# EAGLE design 89c2051-tandy1k-ps2 (EAGLE 4.16)
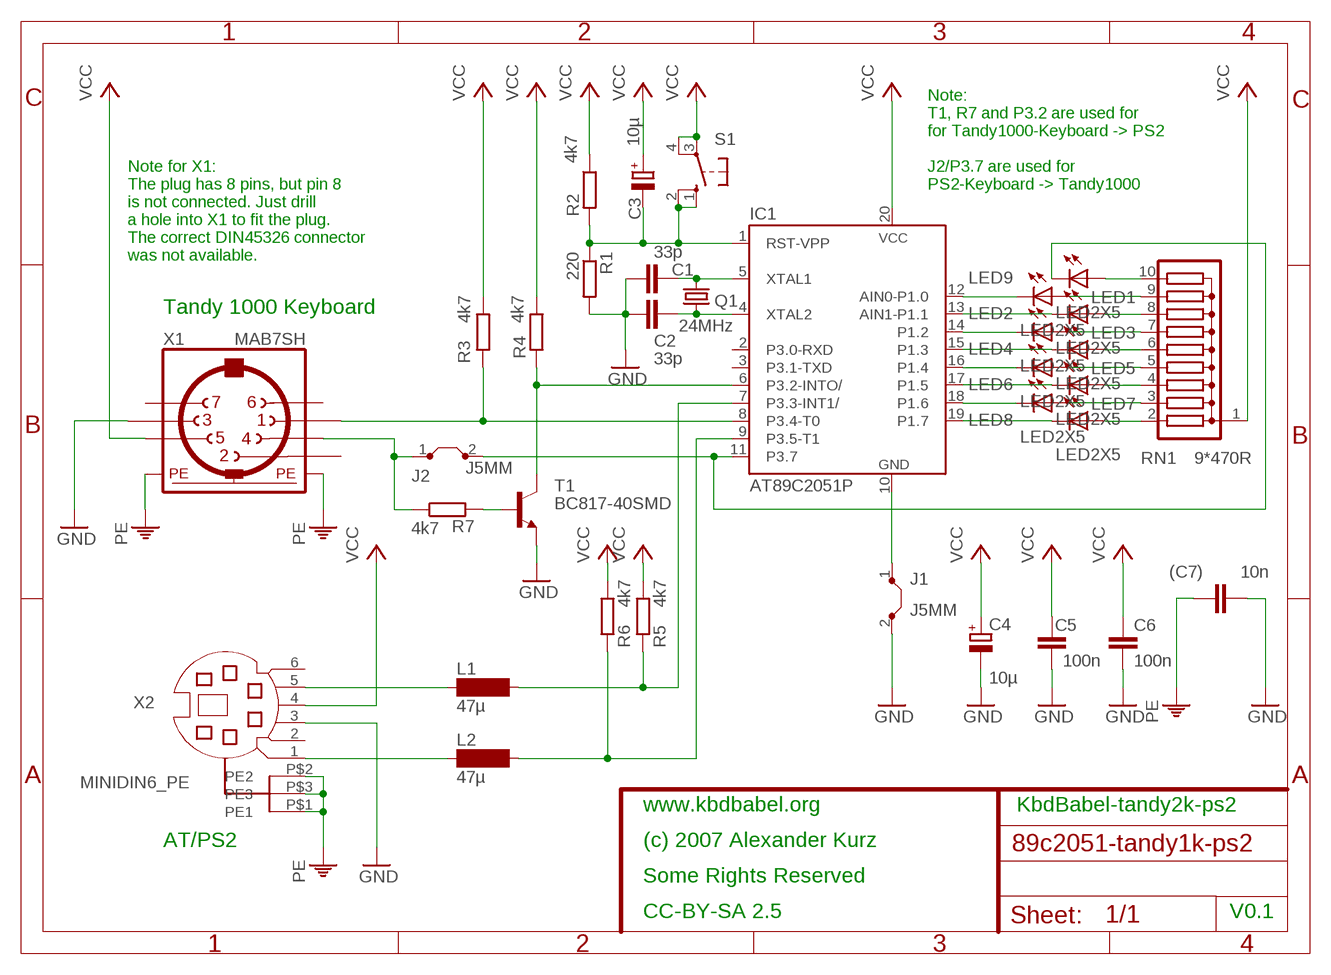
[diagram p0: schematic, sheet 1]

## Parts
(C7)  10n  C-EUC1206K  [C1206K]
C1  33p  C-EUC0805K  [C0805K]
C2  33p  C-EUC0805K  [C0805K]
C3  10µ  CPOL-EUE2-5  [E2-5]
C4  10µ  CPOL-EUE2-5  [E2-5]
C5  100n  C-EUC1206K  [C1206K]
C6  100n  C-EUC1206  [C1206]
IC1  AT89C2051P  [DIL20]
J1  J5MM  [05]
J2  J5MM  [05]
L1  47µ  SD75  [SD75]
L2  47µ  SD75  [SD75]
LED1  LED2X5  [LED2X5]
LED2  LED2X5  [LED2X5]
LED3  LED2X5  [LED2X5]
LED4  LED2X5  [LED2X5]
LED5  LED2X5  [LED2X5]
LED6  LED2X5  [LED2X5]
LED7  LED2X5  [LED2X5]
LED8  LED2X5  [LED2X5]
LED9  LED2X5  [LED2X5]
Q1  24MHz  CRYSTALHC49U70  [HC49U70]
R1  220  R-EU_R1206  [R1206]
R2  4k7  R-EU_R1206  [R1206]
R3  4k7  R-EU_R1206  [R1206]
R4  4k7  R-EU_R1206  [R1206]
R5  4k7  R-EU_R1206  [R1206]
R6  4k7  R-EU_R1206  [R1206]
R7  4k7  R-EU_R1206  [R1206]
RN1  9*470R  G09R  [SIL10]
S1  10-XX  [B3F-10XX]
T1  BC817-40SMD  [SOT23-BEC]
X1  MAB7SH  [MAB7SH]
X2  MINIDIN6_PE  [MINIDIN6_PE]

## Nets
GND: (C7).1 C1.1 C2.2 C4.- C5.1 C6.1 J1.2 R1.2 T1.E X1.3 X2.3
N$1: C1.2 IC1.5(XTAL1) Q1.2
N$2: C2.1 IC1.4(XTAL2) Q1.1
N$3: IC1.10(GND) J1.1
N$4: LED9.A RN1.10
N$5: LED1.A RN1.9
N$6: L1.1 X2.5
N$7: IC1.6(P3.2-INTO/) R4.2 T1.C
N$8: LED2.A RN1.8
N$9: C3.- IC1.1(RST-VPP) R1.1 R2.2 S1.1(S) S1.2(S1)
N$10: IC1.8(P3.4-T0) R3.2 X1.1
N$11: IC1.7(P3.3-INT1/) L1.2 R5.2
N$12: IC1.9(P3.5-T1) L2.2 R6.2
N$13: LED3.A RN1.7
N$14: LED4.A RN1.6
N$15: LED5.A RN1.5
N$16: LED6.A RN1.4
N$17: LED7.A RN1.3
N$18: LED8.A RN1.2
N$19: IC1.19(P1.7) LED8.K(C)
N$20: IC1.18(P1.6) LED7.K(C)
N$21: IC1.17(P1.5) LED6.K(C)
N$22: IC1.16(P1.4) LED5.K(C)
N$23: IC1.15(P1.3) LED4.K(C)
N$24: IC1.14(P1.2) LED3.K(C)
N$25: IC1.13(AIN1-P1.1) LED2.K(C)
N$26: L2.1 X2.1
N$27: IC1.12(AIN0-P1.0) LED1.K(C)
N$28: IC1.11(P3.7) J2.2 LED9.K(C)
N$29: R7.2 T1.B
N$31: J2.1 R7.1 X1.4
PE: (C7).2 X1.PE X1.PE@(PE) X2.P$1(PE1) X2.P$2(PE2) X2.P$3(PE3)
VCC: C3.+ C4.+ C5.2 C6.2 IC1.20(VCC) R2.1 R3.1 R4.1 R5.1 R6.1 RN1.1 S1.3(P) S1.4(P1) X1.5 X2.4
Unconnected: IC1.2(P3.0-RXD) IC1.3(P3.1-TXD) X1.2 X1.6 X1.7 X2.2 X2.6

## Notes on the sheet
- Note:
- T1, R7 and P3.2 are used for
- for Tandy1000-Keyboard -> PS2
- Note for X1: | J2/P3.7 are used for
- The plug has 8 pins, but pin 8 | PS2-Keyboard -> Tandy1000
- is not connected. Just drill
- a hole into X1 to fit the plug.
- The correct DIN45326 connector
- was not available.
- Tandy 1000 Keyboard
- www.kbdbabel.org | KbdBabel-tandy2k-ps2
- AT/PS2 | (c) 2007 Alexander Kurz
- Some Rights Reserved
- CC-BY-SA 2.5 | V0.1

## Library data of the parts
(C7) C1 C2 C5 C6 = rcl:C-EU: CAPACITOR, European symbol
C3 C4 = rcl:CPOL-EU: POLARIZED CAPACITOR, European symbol
IC1 = atmel:AT89C2051: 80C31 MICROCONTROLLER 2 Kbytes FLASH 2.7 V
J1 J2 = jumper:J: Bridge
L1 L2 = inductor-neosid:SD75: INDUCTOR nominal inductance, E12
LED1-LED9 = bla:LED
Q1 = crystal:CRYSTAL: CRYSTAL
R1-R7 = rcl:R-EU_: RESISTOR, European symbol
RN1 = resistor-sil:G09R: SIL RESISTOR
S1 = switch-omron:10-XX: OMRON SWITCH
T1 = transistor-npn:BC817*: NPN Transistor
X1 = con-hirschmann:MAB7SH: Female CONNECTOR 7 pins with shield, horizontal (DIN 45329)
X2 = bla:MINIDIN6_PE

## Board
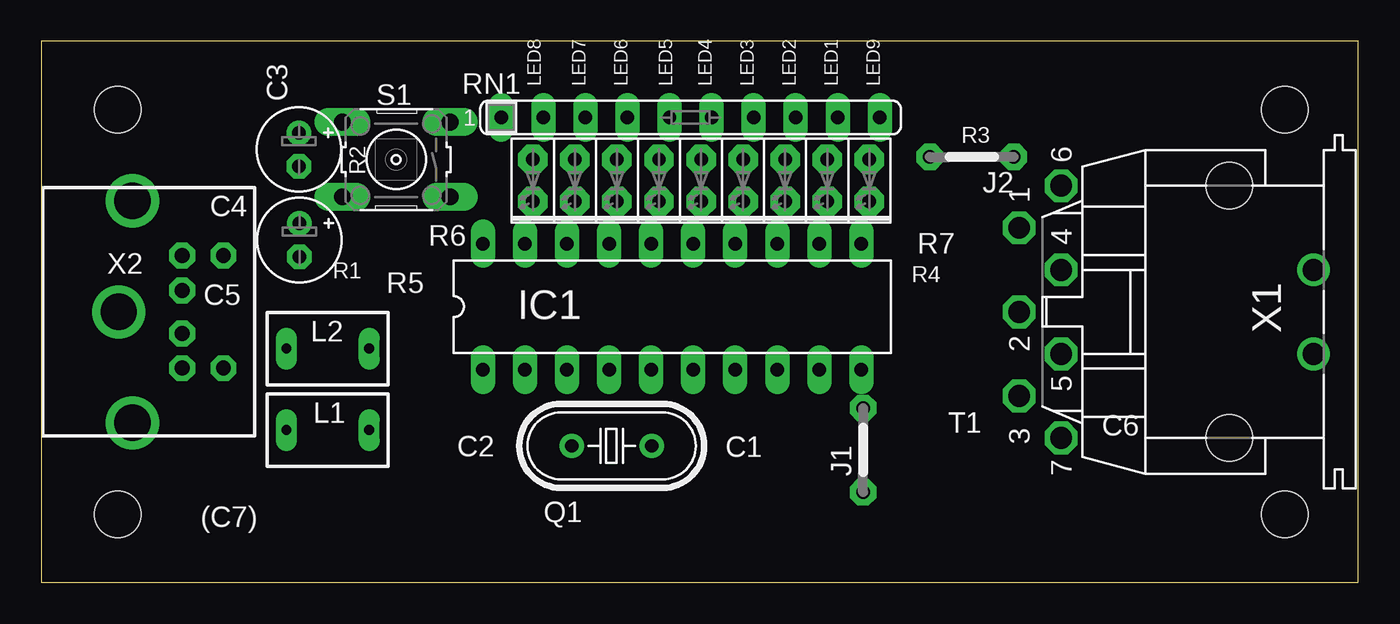
[diagram p1: board, top side]
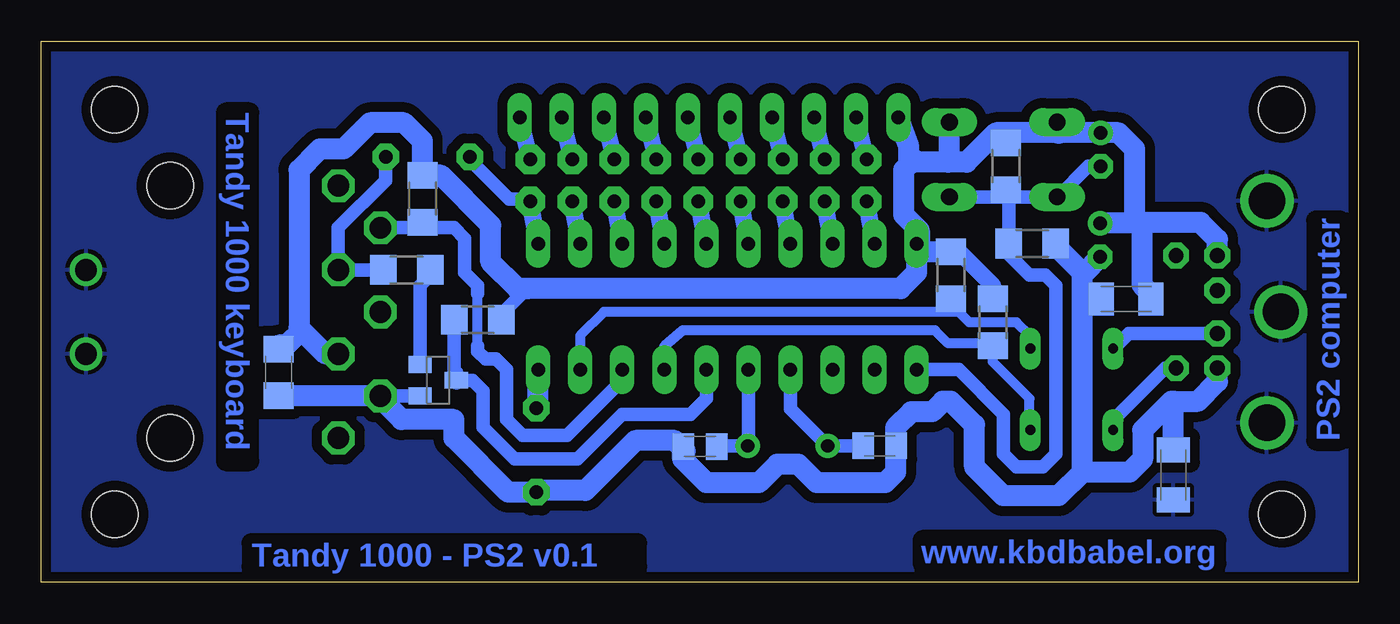
[diagram p2: board, bottom side, seen from below]

Size 79.52 x 32.69 mm. Coordinates in mm from the lower left corner, seen from the top.
Outline: 79.52,0 79.52,32.69 0,32.69 0,0 79.52,0
Copper layers (1*16): Top 0.035mm / dielectric 1.5mm / Bottom 0.035mm
Design rules "default": minimum track width 16mil, minimum drill 24mil, track to track 12mil, track to pad 12mil, pad to pad 16mil, via to via 16mil, smd to smd 16mil, copper to edge 20mil, drill to drill 8mil, minimum pad ring 13mil, minimum via ring 8mil, stop-mask expansion 4mil, vias tented up to drill 0mil, thermal gap 10mil
Holes 2.8 mm at 75.08,4.12 75.08,28.57 4.6,28.57 4.6,4.12

### Footprints (pad centres in the part's own frame; a part is rotated, then mirrored left to right if it is on the bottom)
C1206K = smd 1.5 x 2: 1 -1.5,0; 2 1.5,0
C0805K = smd 1.3 x 1.6: 1 -1,0; 2 1,0
E2-5 = drill 0.813 pad 1.27 round: + -1.016,0 | drill 0.813 pad 1.27 octagon: - 1.016,0
C1206 = smd 1.6 x 1.8: 1 -1.4,0; 2 1.4,0
DIL20 = drill 0.813 long: 1 -11.43,-3.81; 2 -8.89,-3.81; 3 -6.35,-3.81; 4 -3.81,-3.81; 5 -1.27,-3.81; 6 1.27,-3.81; 7 3.81,-3.81; 8 6.35,-3.81; 9 8.89,-3.81; 10 11.43,-3.81; 11 11.43,3.81; 12 8.89,3.81; 13 6.35,3.81; 14 3.81,3.81; 15 1.27,3.81; 16 -1.27,3.81; 17 -3.81,3.81; 18 -6.35,3.81; 19 -8.89,3.81; 20 -11.43,3.81
05 = drill 0.813 pad 1.6 octagon: 1 -2.54,0; 2 2.54,0
SD75 = drill 0.6 long: 1 -2.5,0; 2 2.5,0
LED2X5 = drill 0.813 pad 1.778 octagon: A -1.27,0; K 1.27,0
HC49U70 = drill 0.813 round: 1 -2.413,0; 2 2.413,0
R1206 = smd 1.6 x 1.803: 1 -1.422,0; 2 1.422,0
SIL10 = drill 0.813 long: 1 -11.43,0; 2 -8.89,0; 3 -6.35,0; 4 -3.81,0; 5 -1.27,0; 6 1.27,0; 7 3.81,0; 8 6.35,0; 9 8.89,0; 10 11.43,0
B3F-10XX = drill 1.016 long: 1 -3.251,2.261; 2 3.251,2.261; 3 -3.251,-2.261; 4 3.251,-2.261
SOT23-BEC = smd 1 x 1.4: B -0.95,-1.1; C 0,1.1; E 0.95,-1.1
MAB7SH = drill 1.321 octagon: 1 5.08,12.7; 2 0,12.7; 3 -5.08,12.7; 4 2.54,10.16; 5 -2.54,10.16; 6 7.62,10.16; 7 -7.62,10.16 | drill 1.321 round: PE -2.54,-5.08; PE@ 2.54,-5.08 | hole 2.794: 7.62,0; -7.62,0
MINIDIN6_PE = drill 0.9 octagon: 1 1.3,2.15; 2 -1.3,2.15; 3 3.4,2.15; 4 -3.4,2.15; 5 3.4,4.65; 6 -3.4,4.65 | drill 2.2 round: P$1 0,-1.676; P$2 -6.706,-0.838; P$3 6.706,-0.838

### Placement (x,y rotation side)
(C7)  11.15,6.5 270 bottom
C1  39.75,8.22 0 bottom
C2  28.89,8.25 0 bottom
C3  15.55,26.16 270 top
C4  15.58,20.69 270 top
C5  14.02,17.13 0 bottom
C6  65.19,12.68 90 bottom
IC1  38.09,16.66 0 top
J1  49.62,7.99 270 top
J2  56.19,25.71 180 top
L1  17.3,9.2 0 top
L2  17.3,14.12 0 top
LED1  47.46,24.28 270 top
LED2  44.92,24.28 270 top
LED3  42.38,24.28 270 top
LED4  39.84,24.28 270 top
LED5  37.3,24.28 270 top
LED6  34.76,24.28 270 top
LED7  32.22,24.28 270 top
LED8  29.68,24.28 270 top
LED9  50,24.28 270 top
Q1  34.44,8.25 0 top
R1  19.68,20.47 0 bottom
R2  21.27,25.14 270 bottom
R3  56.51,23.18 270 bottom
R4  53.18,15.87 180 bottom
R5  22.06,15.71 270 bottom
R6  24.6,18.57 270 bottom
R7  57.46,18.89 0 bottom
RN1  39.21,28.09 0 top
S1  21.43,25.55 180 top
T1  55.56,12.22 270 bottom
X1  71.75,16.35 90 top
X2  6.34,16.34 270 top

### Tracks (layer width: path | path; a pad name or v marks a point on that pad's centre or on a via)
GND
  Bottom 0.813: X1.3 58.89,11.42 58.73,11.27 T1.E | X1.3
  Bottom 1.27: X2.3 8.49,12.13 9.68,10.95 11.11,10.95 | 11.11,10.95 11.27,10.95 13.01,9.2 13.01,7.45 13.81,6.66 16.66,6.66 | (C7).1 11.15,10.9 11.11,10.95 | 16.66,6.66 18.09,5.23 21.43,5.23 23.17,6.98 23.17,9.52 24.6,10.95 25.08,10.95 25.71,10.31 26.98,10.31 27.93,9.36 27.93,8.25 | 58.89,11.26 | X1.3 58.89,11.26 | 59.05,11.11 | 59.05,11.11 58.89,11.26 | C6.1 59.22,11.28 59.05,11.11 | C1.1 40.75,8.04 40.63,7.93 40.79,7.77 | C1.1 40.92,8.22 41.27,8.57 43.65,8.57 46.67,5.55 49.52,5.55 J1.2 | J1.2 | 59.05,11.42 | X1.3 59.05,11.42 | J1.2 51.33,5.45 54.6,8.72 54.6,9.84 57.78,9.84 59.05,11.11 | 59.05,11.11 | 59.05,11.11 X1.3 | R1.2 18.26,20.32 16.66,18.73 | 16.66,6.66 16.66,17.3 | 16.66,17.3 16.66,18.73 | 16.66,17.3 16.35,17.3 16.18,17.13 C5.1 | 16.66,18.73 16.5,18.73 15.58,19.65 C4.- | 27.93,8.25 27.93,6.66 28.57,6.03 32.7,6.03 33.81,7.14 35.08,7.14 36.19,6.03 39.36,6.03 40.79,7.45 40.79,8.09 40.75,8.14 C1.1 | 27.93,8.25 | 27.93,8.25 C2.2
N$1
  Bottom 0.813: IC1.5 36.82,8.57 36.98,8.41 36.86,8.28 Q1.2 38.41,8.25 38.44,8.22 C1.2
N$2
  Bottom 0.61: Q1.1 31.9,8.25 | 31.9,8.25
  Bottom 0.813: 31.9,8.25 | 31.9,8.25 Q1.1 32.06,8.25 34.28,10.47 34.28,12.53 34.44,12.69 IC1.4 | C2.1 31.9,8.25 | 31.9,8.25 | IC1.4
N$3
  Bottom 1.27: J1.1 49.52,10.63 IC1.10 | J1.1
N$4
  Bottom 1.016: LED9.A RN1.10
N$5
  Bottom 1.016: LED1.A RN1.9
N$6
  Bottom 0.813: X2.5 11.65,12.94 14.76,9.84 14.76,9.2 L1.1
N$7
  Bottom 0.813: IC1.6 39.36,11.11 40.32,10.15 44.44,10.15 47.14,7.45 50.95,7.45 52.86,9.36 52.86,11.58 53.49,12.22 T1.C | 54.45,12.06 54.46,12.07 T1.C | T1.C 54.46,12.68 | T1.C 54.46,12.55 54.6,12.69 54.6,12.7 R4.2
N$8
  Bottom 1.016: LED2.A RN1.8
N$9
  Bottom 0.813: C3.- 16.28,25.14 18.13,23.29 S1.2 21.27,23.29 | S1.1 24.64,23.29 24.6,23.33 24.56,23.29 21.27,23.29 | 21.27,23.29 21.27,23.33 R2.2 21.27,23.65 21.1,23.48 R1.1 | 21.11,20.31 21.1,20.32 R1.1 | R1.1 20.95,20.47 21.11,20.31 | 21.11,20.31 21.11,19.84 19.84,18.57 18.89,18.57 18.25,17.93 18.25,7.77 19.04,6.98 20.63,6.98 21.43,7.77 21.43,10.15 24.12,12.85 IC1.1 | IC1.1
N$10
  Bottom 0.61: 53.18,14.28 53.18,17.46
  Bottom 0.813: IC1.8 44.44,12.38 44.52,12.3 | 56.53,21.44 56.51,21.42 54.6,21.42 53.97,20.79 53.97,18.73 53.18,17.93 53.18,17.46 | 56.53,21.44 R3.2 | X1.1 | 56.53,21.44 59.03,21.44 X1.1 | 53.18,14.28 53.18,13.96 52.7,13.49 52.06,13.49 51.43,12.85 51.43,9.84 50.48,8.88 47.78,8.88 44.44,12.22 44.52,12.3 | 44.52,12.3
N$11
  Bottom 0.61: IC1.7 41.9,14.28 40.79,15.23 25.55,15.23 24.76,14.44 22.22,14.44 R5.2 22.06,13.33 19.84,11.11 19.84,9.36 19.8,9.32 L1.2
N$12
  Bottom 0.61: L2.2 19.8,14.88 20.63,15.71 23.49,15.71 24.05,16.27 | 24.05,16.27 24.44,16.66 24.44,17.14 24.45,17.15 R6.2 | IC1.9 46.98,14.92 45.56,16.34 23.97,16.34 24.05,16.27 | 24.05,16.27
N$13
  Bottom 1.016: LED3.A | LED3.A RN1.7
N$14
  Bottom 1.016: LED4.A RN1.6
N$15
  Bottom 1.016: LED5.A | LED5.A RN1.5
N$16
  Bottom 1.016: LED6.A RN1.4
N$17
  Bottom 1.016: LED7.A | LED7.A RN1.3
N$18
  Bottom 1.016: LED8.A RN1.2
N$19
  Bottom 1.016: IC1.19 LED8.K
N$20
  Bottom 1.016: LED7.K | IC1.18 LED7.K
N$21
  Bottom 1.016: IC1.17 | IC1.17 LED6.K
N$22
  Bottom 1.016: LED5.K | IC1.16 LED5.K
N$23
  Bottom 1.016: IC1.15 | IC1.15 LED4.K
N$24
  Bottom 1.016: LED3.K | LED3.K | IC1.14 LED3.K
N$25
  Bottom 1.016: IC1.13 LED2.K
N$26
  Bottom 0.813: L2.1 14.76,14.12 13.84,15.04 X2.1
N$27
  Bottom 1.016: IC1.12 | IC1.12 LED1.K
N$28
  Bottom 0.813: J2.2 53.65,25.55 51.27,23.17 50,23.17
  Bottom 1.016: 50,23.17 LED9.K IC1.11
N$29
  Bottom 0.813: R7.2 56.04,18.57 56.03,18.57 56.66,17.94 T1.B
N$31
  Bottom 0.813: X1.4 | R7.1 X1.4 | J2.1 58.73,24.28 61.59,21.42 61.59,19.2 | 61.59,19.2 | X1.4 61.59,19.2
PE
  pour Bottom (isolate 0.61): 79.67,-0.13 79.64,32.85 -0.18,32.85 -0.14,-0.1
VCC
  Bottom 0.813: 50.16,17.75 50.16,17.77 51.75,16.18 R4.1
  Bottom 1.016: R6.1 24.13,19.99 24.12,20 22.06,17.93 R5.1
  Bottom 1.27: RN1.1 27.14,26.35 27.14,25.39 26.82,25.39 | X2.4 8.49,20.72 9.52,21.74 13.01,21.74 | 13.01,21.74 13.17,21.74 | 13.05,21.7 13.49,21.7 | 13.49,21.7 C4.+ | 13.01,21.74 13.05,21.7 | 13.49,21.7 13.49,26.19 14.47,27.17 C3.+ 18.09,27.17 | 20.95,26.66 21.11,26.5 21.17,26.56 R2.1 21.27,26.98 21.43,27.14 21.43,27.17 | 62.86,26.03 63.97,24.92 | C6.2 65.19,14.33 64.71,14.33 63.81,15.23 | R3.1 56.36,24.61 56.35,24.6 55.4,24.6 52.38,21.58 52.38,19.36 50.78,17.75 50.16,17.75 27.64,17.75 26.66,18.73 26.66,20 | 62.86,26.03 | 62.86,26.03 62.7,26.19 61.27,26.19 59.68,27.77 57.62,27.77 56.51,26.66 R3.1 | R3.1 | 18.09,27.17 21.43,27.17 | 21.43,27.17 21.87,27.17 23.65,25.39 24.76,25.39 | 24.76,25.39 26.82,25.39 | S1.3 24.68,25.48 24.76,25.39 | 18.09,27.17 18.09,27.14 18.17,27.22 S1.4 | 26.51,20.47 | 26.51,20.47 IC1.20 26.66,20 | 26.66,20 26.66,20.31 26.51,20.47 | R6.1 26.66,19.99 26.66,20 | 26.51,20.47 26.51,21.27 27.46,22.22 27.46,24.92 26.82,25.55 26.82,25.39 | C5.2 12.52,17.16 12.38,17.3 13.05,17.97 13.05,21.7 | X1.5 62.38,13.8 63.81,15.23 | 63.81,15.23 63.97,15.39 63.97,24.92 | 63.97,24.92

### Text on the board
Bottom: Tandy 1000 keyboard | PS2 computer | www.kbdbabel.org | Tandy 1000 - PS2 v0.1